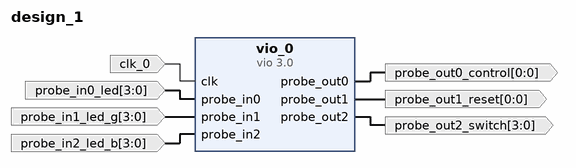
[diagram p0: block diagram of the top level]
# Vivado block design design_1, xc7a35ticsg324-1L, Vivado 2025.2
create_bd_design design_1

create_bd_port -dir I -type clk clk_0
create_bd_port -dir I -from 3 -to 0 probe_in0_led
create_bd_port -dir I -from 3 -to 0 probe_in1_led_g
create_bd_port -dir I -from 3 -to 0 probe_in2_led_b
create_bd_port -dir O -from 0 -to 0 probe_out0_control
create_bd_port -dir O -from 0 -to 0 probe_out1_reset
create_bd_port -dir O -from 3 -to 0 probe_out2_switch

create_bd_cell -type ip -vlnv xilinx.com:ip:vio:3.0 vio_0
set_property -dict [list \
  CONFIG.C_NUM_PROBE_IN 3 \
  CONFIG.C_NUM_PROBE_OUT 3 \
  CONFIG.C_PROBE_IN0_WIDTH 4 \
  CONFIG.C_PROBE_IN1_WIDTH 4 \
  CONFIG.C_PROBE_IN2_WIDTH 4 \
  CONFIG.C_PROBE_OUT2_WIDTH 4 \
] [get_bd_cells vio_0]

# ---- connections ----

connect_bd_net -net clk_0_1 [get_bd_ports clk_0] [get_bd_pins vio_0/clk]
connect_bd_net -net probe_in0_0_1 [get_bd_ports probe_in0_led] [get_bd_pins vio_0/probe_in0]
connect_bd_net -net probe_in1_0_1 [get_bd_ports probe_in1_led_g] [get_bd_pins vio_0/probe_in1]
connect_bd_net -net probe_in2_0_1 [get_bd_ports probe_in2_led_b] [get_bd_pins vio_0/probe_in2]
connect_bd_net [get_bd_pins vio_0/probe_out0] [get_bd_ports probe_out0_control]
connect_bd_net [get_bd_pins vio_0/probe_out1] [get_bd_ports probe_out1_reset]
connect_bd_net [get_bd_pins vio_0/probe_out2] [get_bd_ports probe_out2_switch]

validate_bd_design
save_bd_design
